# EAGLE schematic ModuleCapteur (EAGLE 5.06)
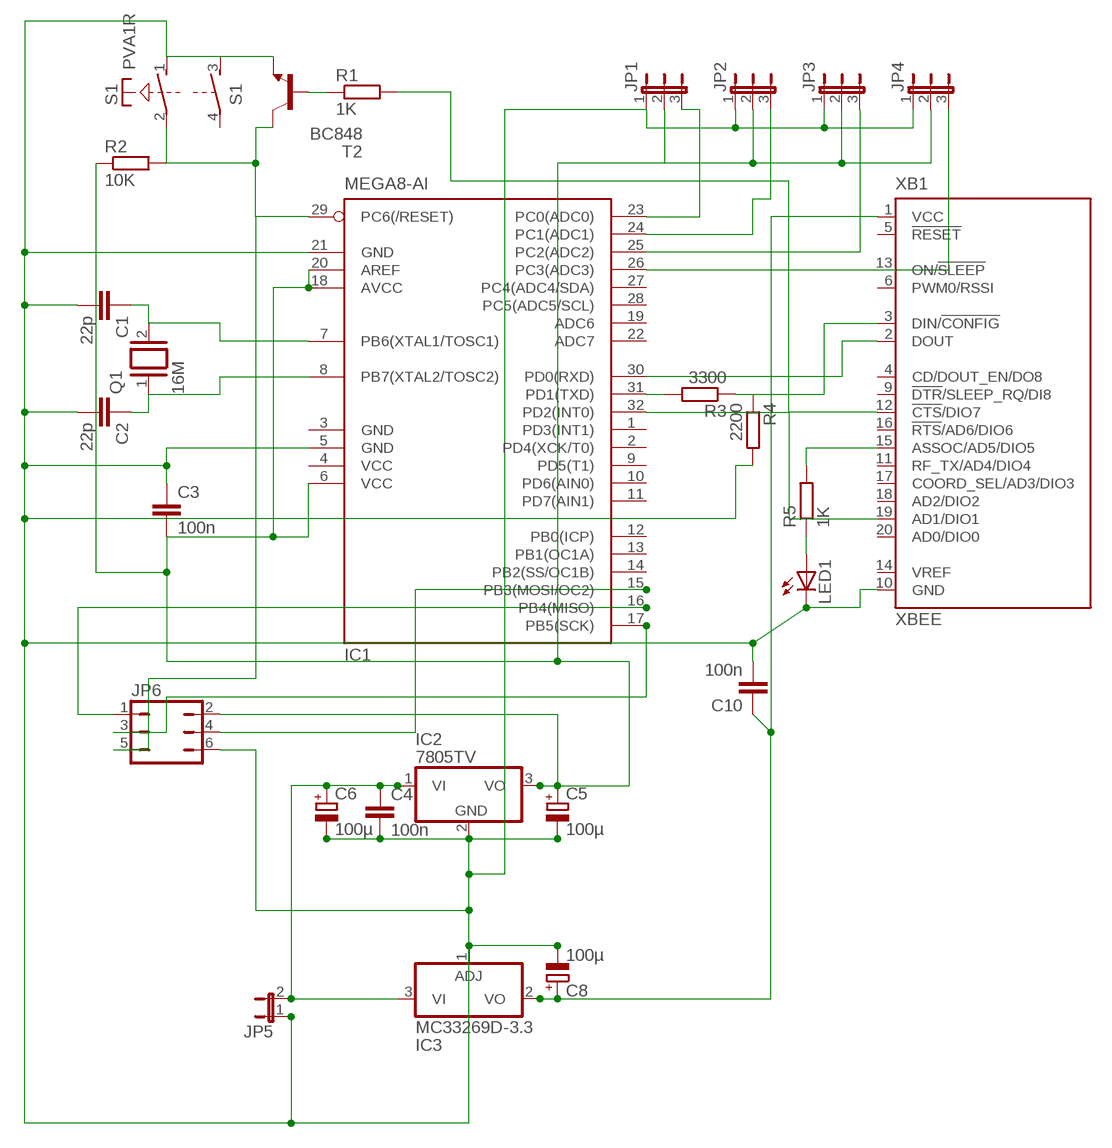
[diagram p0: schematic, sheet 1]

## Parts
C1  22p  C-EU025-024X044  [C025-024X044]
C2  22p  C-EU025-024X044  [C025-024X044]
C3  100n  C-EU025-024X044  [C025-024X044]
C4  100n  C-EU025-025X050  [C025-025X050]
C5  100µ  CPOL-EUE1.8-4  [E1,8-4]
C6  100µ  CPOL-EUE1.8-4  [E1,8-4]
C8  100µ  CPOL-EUE1.8-4  [E1,8-4]
C10  100n  C-EU025-024X044  [C025-024X044]
IC1  MEGA8-AI  [TQFP32-08]
IC2  7805TV  [TO220V]
IC3  MC33269D-3.3  [DPACK]
JP1  JP2E  [JP2]
JP2  JP2E  [JP2]
JP3  JP2E  [JP2]
JP4  JP2E  [JP2]
JP5  JP1E  [JP1]
JP6  JP3Q  [JP3Q]
LED1  LED3MM  [LED3MM]
Q1  16M  XTAL  [Q]
R1  1K  R-EU_0204/7  [0204/7]
R2  10K  R-EU_0204/7  [0204/7]
R3  3300  R-EU_0204/7  [0204/7]
R4  2200  R-EU_0204/7  [0204/7]
R5  1K  R-EU_0204/7  [0204/7]
S1  PVA1R  [PVA1R]
T2  BC848  [SOT23]
XB1  XBEE  [XBEE]

## Nets
N$2: C1.1 IC1.7(PB6(XTAL1/TOSC1)) Q1.2
N$3: C2.1 IC1.8(PB7(XTAL2/TOSC2)) Q1.1
N$4: R1.1 T2.1(B)
N$6: IC1.29(PC6(/RESET)) JP6.5 R2.2 S1.2(1:P) T2.3(C)
N$7: IC1.32(PD2(INT0)) XB1.19(AD1/DIO1)
N$8: IC1.31(PD1(TXD)) R3.2
N$9: R3.1 R4.1 XB1.3(DIN/!CONFIG)
N$10: C8.+ C10.1 IC3.2(VO) XB1.1(VCC)
N$11: IC1.30(PD0(RXD)) XB1.2(DOUT)
N$12: IC1.23(PC0(ADC0)) JP1.3
N$13: LED1.A R5.1
N$14: R5.2 XB1.15(ASSOC/AD5/DIO5)
N$15: IC1.24(PC1(ADC1)) JP2.3
N$16: IC1.25(PC2(ADC2)) JP3.3
N$17: IC1.26(PC3(ADC3)) JP4.3
N$18: R1.2 XB1.12(!CTS!/DIO7)
N$19: C4.1 C6.+ IC2.1(VI) IC3.3(VI) JP5.2
N$20: C3.2 C5.+ IC1.6(VCC) IC1.18(AVCC) IC1.20(AREF) IC2.3(VO) JP1.2 JP2.2 JP3.2 JP4.2 JP6.2 R2.1
N$21: C1.2 C2.2 C3.1 C4.2 C5.- C6.- C8.- C10.2 IC1.5(GND) IC1.21(GND) IC2.2(GND) IC3.1(ADJ) JP1.1 JP2.1 JP3.1 JP4.1 JP5.1 JP6.6 LED1.K(C) R4.2 S1.1(1:S) T2.2(E) XB1.10(GND)
N$22: IC1.17(PB5(SCK)) JP6.3
N$23: IC1.16(PB4(MISO)) JP6.1
N$25: IC1.15(PB3(MOSI/OC2)) JP6.4
Unconnected: IC1.1(PD3(INT1)) IC1.2(PD4(XCK/T0)) IC1.9(PD5(T1)) IC1.10(PD6(AIN0)) IC1.11(PD7(AIN1)) IC1.12(PB0(ICP)) IC1.13(PB1(OC1A)) IC1.14(PB2(SS/OC1B)) IC1.19(ADC6) IC1.22(ADC7) IC1.27(PC4(ADC4/SDA)) IC1.28(PC5(ADC5/SCL)) S1.3(2:S) S1.4(2:P) XB1.4(CD/DOUT_EN/DO8) XB1.5(!RESET) XB1.6(PWM0/RSSI) XB1.9(!DTR!/SLEEP_RQ/DI8) XB1.11(RF_TX/AD4/DIO4) XB1.13(ON/!SLEEP) XB1.14(VREF) XB1.16(!RTS!/AD6/DIO6) XB1.17(COORD_SEL/AD3/DIO3) XB1.18(AD2/DIO2) XB1.20(AD0/DIO0)

## Power pins joined to a net without a drawn wire
GND: IC1.3(GND)
VCC: IC1.4(VCC)

## Library data of the parts
C1-C4 C10 = rcl:C-EU: CAPACITOR, European symbol
C5 C6 C8 = rcl:CPOL-EU: POLARIZED CAPACITOR, European symbol
IC1 = atmel:MEGA8: MICROCONTROLLER 8 Kbytes FLASH, 1 kbytes SRAM, 512 bytes EEPROM, USART, 6-channel 10 bit ADC, 2-channel 8 bit ADC Pin compatible with Atmega48, ATMega88, ATMega168 Source: avr.lbr
IC2 = linear:78*: Positive VOLTAGE REGULATOR Source: http://cache.national.com/ds/LM/LM78L05.pdf http://www.fairchildsemi.com/ds/LM/LM7805.pdf
IC3 = linear:MC33269?*: Adjustable Output Low Dropout Voltage Regulator 800 mA Source: http://www.onsemi.com/pub/Collateral/MC33269-D.PDF
JP1-JP4 = jumper:JP2E: JUMPER
JP5 = jumper:JP1E: JUMPER
JP6 = jumper:JP3Q: JUMPER
LED1 = led:LED: LED OSRAM: - CHIPLED LG R971, LG N971, LY N971, LG Q971, LY Q971, LO R971, LY R971 LH N974, LH R974 LS Q976, LO Q976, LY Q976 LO Q996 - Hyper CHIPLED LW Q18S LB Q993, LB Q99A, LB R99A - SideLED LS A670, LO A670, LY A670, LG A670, LP A670 LB A673, LV A673, LT A673, LW A673 LH A674 LY A675 LS A676, LA A676, LO A676, LY A676, LW A676 LS A679, LY A679, LG A679 - Hyper Micro SIDELED® LS Y876, LA Y876, LO Y876, LY Y876 LT Y87S - SmartLED LW L88C, LW L88S LB L89C, LB L89S, LG L890 LS L89K, LO L89K, LY L89K LS L896, LA L896, LO L896, LY L896 - TOPLED LS T670, LO T670, LY T670, LG T670, LP T670 LSG T670, LSP T670, LSY T670, LOP T670, LYG T670 LG T671, LOG T671, LSG T671 LB T673, LV T673, LT T673, LW T673 LH T674 LS T676, LA T676, LO T676, LY T676, LB T676, LH T676, LSB T676, LW T676 LB T67C, LV T67C, LT T67C, LS T67K, LO T67K, LY T67K, LW E67C LS E67B, LA E67B, LO E67B, LY E67B, LB E67C, LV E67C, LT E67C LW T67C LS T679, LY T679, LG T679 LS T770, LO T770, LY T770, LG T770, LP T770 LB T773, LV T773, LT T773, LW T773 LH T774 LS E675, LA E675, LY E675, LS T675 LS T776, LA T776, LO T776, LY T776, LB T776 LHGB T686 LT T68C, LB T68C - Hyper Mini TOPLED® LB M676 - Mini TOPLED Santana® LG M470 LS M47K, LO M47K, LY M47K Source: http://www.osram.convergy.de LUXEON: - LUMILED® LXK2-PW12-R00, LXK2-PW12-S00, LXK2-PW14-U00, LXK2-PW14-V00 LXK2-PM12-R00, LXK2-PM12-S00, LXK2-PM14-U00 LXK2-PE12-Q00, LXK2-PE12-R00, LXK2-PE12-S00, LXK2-PE14-T00, LXK2-PE14-U00 LXK2-PB12-K00, LXK2-PB12-L00, LXK2-PB12-M00, LXK2-PB14-N00, LXK2-PB14-P00, LXK2-PB14-Q00 LXK2-PR12-L00, LXK2-PR12-M00, LXK2-PR14-Q00, LXK2-PR14-R00 LXK2-PD12-Q00, LXK2-PD12-R00, LXK2-PD12-S00 LXK2-PH12-R00, LXK2-PH12-S00 LXK2-PL12-P00, LXK2-PL12-Q00, LXK2-PL12-R00 Source: www.luxeon.com KINGBRIGHT: KA-3528ASYC Source: www.kingbright.com
Q1 = special:XTAL: CRYSTAL
R1 = rcl:R-EU_: RESISTOR, European symbol
R2-R5 = resistor:R-EU_: RESISTOR, European symbol
S1 = switch-misc:PVA1R: ITT SWITCH
T2 = transistor:BC848: NPN TRANSISTOR
XB1 = maxstream:XBEE: XBee (TM) /XBee-PRO(TM) OEM RF Modules Source: MaxStream, Inc. xbee_productmanual.pdf